# Altium schematic sheet Peripheral.SchDoc
size A
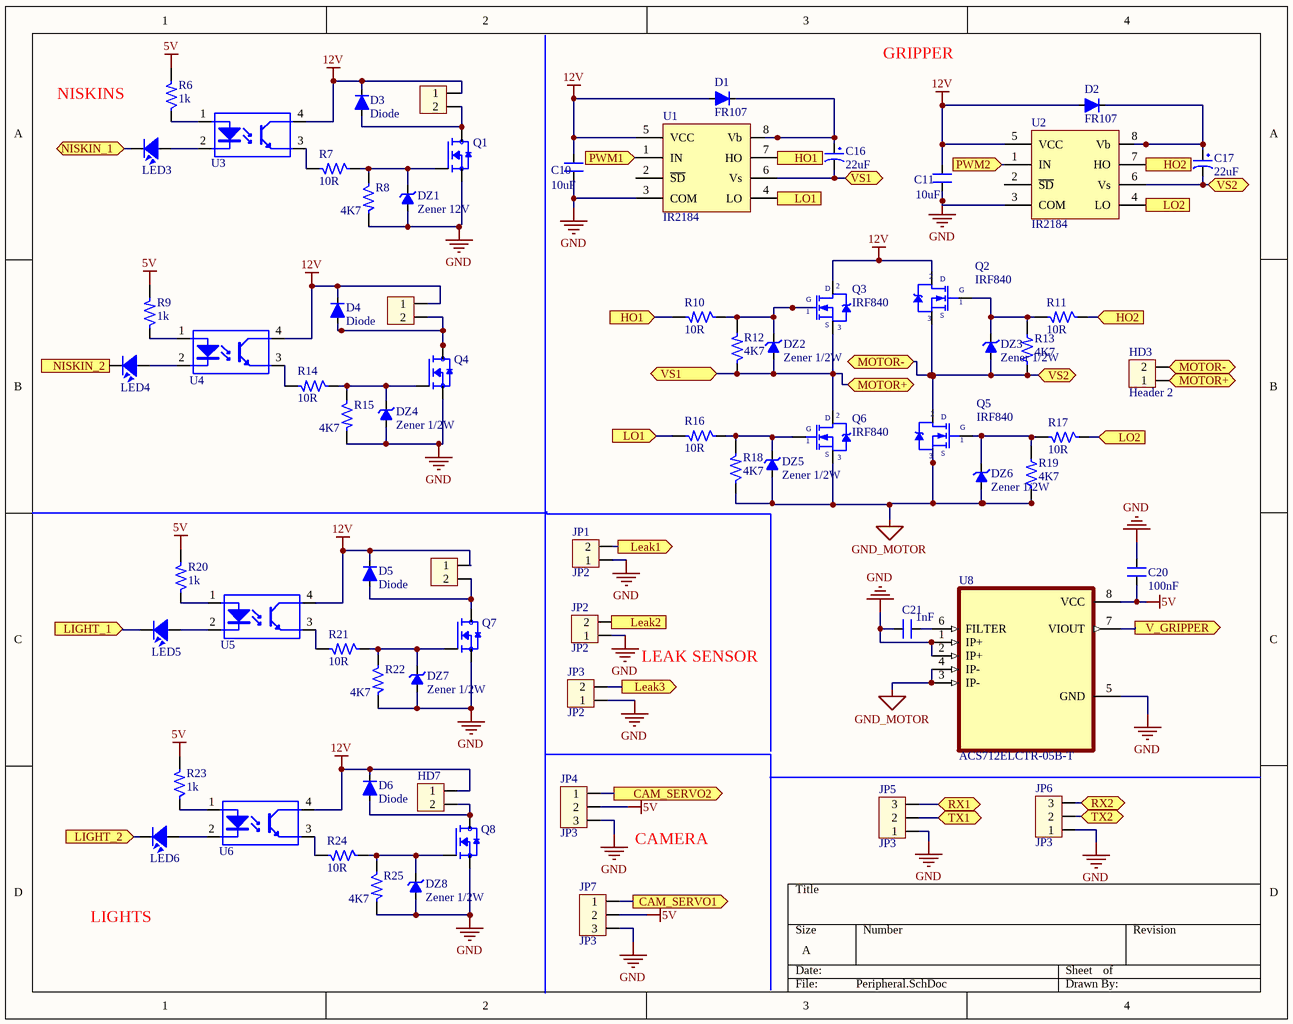
[diagram p0: Peripheral.SchDoc]

## Parts
C10  10uF  [SM-0805]
C11  10uF  [SM-0805]
C16  22uF  [SM-Cap-1206]
C17  22uF  [SM-Cap-1206]
C20  100nF  [SM-0805]
C21  1nF  [SM-0805]
D1  FR107  [SOD323]
D2  FR107  [SOD323]
D3  Diode  [SOD323]
D4  Diode  [SOD323]
D5  Diode  [SOD323]
D6  Diode  [SOD323]
DZ1  Zener 12V  [SOD-80]
DZ2  Zener 1/2W  [SOD-80]
DZ3  Zener 1/2W  [SOD-80]
DZ4  Zener 1/2W  [SOD-80]
DZ5  Zener 1/2W  [SOD-80]
DZ6  Zener 1/2W  [SOD-80]
DZ7  Zener 1/2W  [SOD-80]
DZ8  Zener 1/2W  [SOD-80]
HD3  Header 2  [HED2]
HD4  Header 2  [HED2]  (value not drawn)
HD5  Header 2  [HED2]  (value not drawn)
HD6  Header 2  [HED2]  (value not drawn)
HD7  Header 2  [HED2]  (value not drawn)
JP1  JP2  [CON2]
JP2  JP2  [CON2]
JP3  JP2  [CON2]
JP4  JP3  [CON3]
JP5  JP3  [CON3]
JP6  JP3  [CON3]
JP7  JP3  [CON3]
LED3  LED SMD  [SM-LED-0805-Blue]  (value not drawn)
LED4  LED SMD  [SM-LED-0805-Blue]  (value not drawn)
LED5  LED SMD  [SM-LED-0805-Blue]  (value not drawn)
LED6  LED SMD  [SM-LED-0805-Blue]  (value not drawn)
Q1  IPD025N06N  [DPAK229P994X241-3N]  (value not drawn)
Q2  IRF840  [QTO-220]
Q3  IRF840  [QTO-220]
Q4  IPD025N06N  [DPAK229P994X241-3N]  (value not drawn)
Q5  IRF840  [QTO-220]
Q6  IRF840  [QTO-220]
Q7  IPD025N06N  [DPAK229P994X241-3N]  (value not drawn)
Q8  IPD025N06N  [DPAK229P994X241-3N]  (value not drawn)
R6  1k  [SM-RES-0805]
R7  10R  [SM-RES-0805]
R8  4K7  [SM-RES-0805]
R9  1k  [SM-RES-0805]
R10  10R  [SM-RES-0805]
R11  10R  [SM-RES-0805]
R12  4K7  [SM-RES-0805]
R13  4K7  [SM-RES-0805]
R14  10R  [SM-RES-0805]
R15  4K7  [SM-RES-0805]
R16  10R  [SM-RES-0805]
R17  10R  [SM-RES-0805]
R18  4K7  [SM-RES-0805]
R19  4K7  [SM-RES-0805]
R20  1k  [SM-RES-0805]
R21  10R  [SM-RES-0805]
R22  4K7  [SM-RES-0805]
R23  1k  [SM-RES-0805]
R24  10R  [SM-RES-0805]
R25  4K7  [SM-RES-0805]
U1  IR2184  [SO-8]
U2  IR2184  [SO-8]
U3  OPTO  [DIP4/W0.3]  (value not drawn)
U4  OPTO  [DIP4/W0.3]  (value not drawn)
U5  OPTO  [DIP4/W0.3]  (value not drawn)
U6  OPTO  [DIP4/W0.3]  (value not drawn)
U8  ACS712ELCTR-05B-T  [SOIC127P600X175-8N]

## Ports
CAM_SERVO1 (out), CAM_SERVO2 (out), HO1 (in), HO1 (out), HO2 (in), HO2 (out), Leak1 (out), Leak2 (out), Leak3 (out), LIGHT_1 (in), LIGHT_2 (in), LO1 (in), LO1 (out), LO2 (in), LO2 (out), MOTOR+ (bidir), MOTOR- (bidir), NISKIN_1 (bidir), NISKIN_2 (in), PWM1 (in), PWM2 (in), RX1 (bidir), RX2 (bidir), TX1 (bidir), TX2 (bidir), V_GRIPPER (out), VS1 (bidir), VS2 (bidir)

## Nets
5V: C20.1 JP4.2 JP7.2 R6.2 R9.2 R20.2 R23.2 U8.8(VCC)
12V: C10.2 C11.2 D1.1(Anode) D2.1(Anode) D3.2(Cathode) D4.2(Cathode) D5.2(Cathode) D6.2(Cathode) HD4.1 HD5.1 HD6.1 HD7.1 Q2.2(D) Q3.2(D) U1.5(VCC) U2.5(VCC) U3.4(C) U4.4(C) U5.4(C) U6.4(C)
GND: C10.1 C11.1 C20.2 C21.2 DZ1.1(Cathode) DZ4.1(Cathode) DZ7.1(Cathode) DZ8.1(Cathode) JP1.1 JP2.1 JP3.1 JP4.3 JP5.1 JP6.1 JP7.3 Q1.3(S) Q4.3(S) Q7.3(S) Q8.3(S) R8.2 R15.2 R22.2 R25.2 U1.3(COM) U2.3(COM) U8.1(IP+) U8.2(IP+) U8.5(GND)
GND_MOTOR: DZ5.1(Cathode) DZ6.1(Cathode) Q5.3(S) Q6.3(S) R18.1 R19.1 U8.3(IP-) U8.4(IP-)
CAM_SERVO1: JP7.1 ; port CAM_SERVO1
CAM_SERVO2: JP4.1 ; port CAM_SERVO2
HO1: R10.2 U1.7(HO) ; port HO1
HO2: R11.1 U2.7(HO) ; port HO2
Leak1: JP1.2 ; port Leak1
Leak2: JP2.2 ; port Leak2
Leak3: JP3.2 ; port Leak3
LIGHT_1: LED5.2 ; port LIGHT_1
LIGHT_2: LED6.2 ; port LIGHT_2
LO1: R16.2 U1.4(LO) ; port LO1
LO2: R17.1 U2.4(LO) ; port LO2
MOTOR+: C16.2 DZ2.1(Cathode) HD3.1 Q3.3(S) Q6.2(D) R12.1 U1.6(Vs) ; port VS1, port MOTOR+
MOTOR-: C17.2 DZ3.1(Cathode) HD3.2 Q2.3(S) Q5.2(D) R13.1 U2.6(Vs) ; port VS2, port MOTOR-
NISKIN_1: LED3.2 ; port NISKIN_1
NISKIN_2: LED4.2 ; port NISKIN_2
PWM1: U1.1(IN) ; port PWM1
PWM2: U2.1(IN) ; port PWM2
RX1: JP5.3 ; port RX1
RX2: JP6.3 ; port RX2
TX1: JP5.2 ; port TX1
TX2: JP6.2 ; port TX2
V_GRIPPER: U8.7(VIOUT) ; port V_GRIPPER
NetC16_1: C16.1 D1.2(Cathode) U1.8(Vb)
NetC17_1: C17.1 D2.2(Cathode) U2.8(Vb)
NetC21_1: C21.1 U8.6(FILTER)
NetD3_1: D3.1(Anode) HD4.2 Q1.TAB(D)
NetD4_1: D4.1(Anode) HD5.2 Q4.TAB(D)
NetD5_1: D5.1(Anode) HD6.2 Q7.TAB(D)
NetD6_1: D6.1(Anode) HD7.2 Q8.TAB(D)
NetDZ1_2: DZ1.2(Anode) Q1.1(G) R7.1 R8.1
NetDZ2_2: DZ2.2(Anode) Q3.1(G) R10.1 R12.2
NetDZ3_2: DZ3.2(Anode) Q2.1(G) R11.2 R13.2
NetDZ4_2: DZ4.2(Anode) Q4.1(G) R14.1 R15.1
NetDZ5_2: DZ5.2(Anode) Q6.1(G) R16.1 R18.2
NetDZ6_2: DZ6.2(Anode) Q5.1(G) R17.2 R19.2
NetDZ7_2: DZ7.2(Anode) Q7.1(G) R21.1 R22.1
NetDZ8_2: DZ8.2(Anode) Q8.1(G) R24.1 R25.1
NetLED3_1: LED3.1 U3.2(K)
NetLED4_1: LED4.1 U4.2(K)
NetLED5_1: LED5.1 U5.2(K)
NetLED6_1: LED6.1 U6.2(K)
NetR6_1: R6.1 U3.1(A)
NetR7_2: R7.2 U3.3(E)
NetR9_1: R9.1 U4.1(A)
NetR14_2: R14.2 U4.3(E)
NetR20_1: R20.1 U5.1(A)
NetR21_2: R21.2 U5.3(E)
NetR23_1: R23.1 U6.1(A)
NetR24_2: R24.2 U6.3(E)

Not connected (* = marked no-connect by the designer): U1 2(~{SD}); U2 2(~{SD})

## Notes on the sheet
- NISKINS
- GRIPPER
- LEAK SENSOR
- CAMERA
- LIGHTS

## Library data of the parts
C10 C11 C21 = CM: Cap SMD; Value: 103
C16 C17 = CP1: Cap P  0,1uF < 22uF , 16 - 50V; Value: 10uF/50V; Description 1: 10 => 220uF/6,3V/10V - 10uF => 100uF/16V; Description 2: 0,1uF => 33uF/50V - 10uF => 22uF/63V; Description 3: 0,47uF => 10uF/100V
C20 = CN2: Cap np 104 => 105pF; Value: 0.1uF
D1-D6 = Diode SMD
DZ1-DZ8 = Zener SMD
HD3-HD7 = Hed2: Header 2 (Green); Value: Header 2
JP1-JP3 = Con2: Connector 2; Value: Connector 2
JP4-JP7 = Con3: Connector 3; Value: Connector 3
LED3-LED6 = LED-SMD-0805
Q1 Q4 Q7 Q8 = IPD025N06N: N-Channel 60V 90A _Tc_ 3W _Ta_, 167W _Tc_ Surface Mount PG-TO252-3; MF: Infineon Technologies; Package: TO-252-3 Infineon Technologies; MP: IPD025N06N; Value: *; SnapEDA_Link: https://www.snapeda.com/parts/IPD025N06N/Infineon%20Technologies/view-part/666018/?ref=snap; Price: None; Availability: Unavailable
Q2 Q3 Q5 Q6 = IRF840: MOSFET N - CHANNEL 500V - 0.75 - 8A - TO-220; Value: IRF840
R6-R25 = R: Resistor 1/4W; Value: R1/4W - 1K
U1 U2 = IR2184: Half-Bridge Driver
U8 = ACS712ELCTR-05B-T: Current Sensor 5A 1 Channel Hall Effect, Open Loop Bidirectional 8-SOIC _0.154, 3.90mm Width_; MF: Allegro MicroSystems LLC; MP: ACS712ELCTR-05B-T; Digi-Key_Part_Number: 620-1189-1-ND; Package: SOIC-8 Allegro MicroSystems LLC; Digi-Key_Purchase_URL: https://www.digikey.in/product-detail/en/allegro-microsystems/ACS712ELCTR-05B-T/620-1189-1-ND/1284606?utm_source=snapeda&utm_medium=aggregator&utm_campaign=symbol; Value: *; SnapEDA_Link: https://www.snapeda.com/parts/ACS712ELCTR-05B-T/Allegro%20MicroSystems%20LLC/view-part/46765/?ref=snap